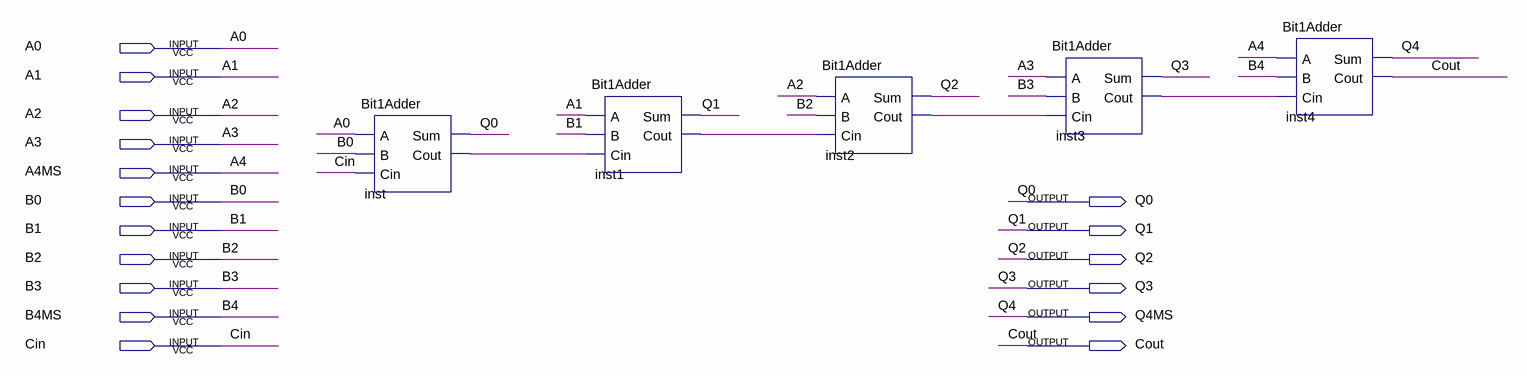
[diagram p0: schematic sheet]
// Quartus schematic AdderV2.bdf as structural Verilog: 5 symbols, 17 pins
module AdderV2 (
  input  A0,
  input  A1,
  input  A2,
  input  A3,
  input  A4MS,
  input  B0,
  input  B1,
  input  B2,
  input  B3,
  input  B4MS,
  input  Cin,
  output Q0,
  output Q1,
  output Q2,
  output Q3,
  output Q4MS,
  output Cout
);

  wire inst1_cout, inst2_cout, inst3_cout, inst_cout;

  Bit1Adder inst (.A(A0), .B(B0), .Cin(Cin), .Sum(Q0), .Cout(inst_cout));
  Bit1Adder inst1 (.A(A1), .B(B1), .Cin(inst_cout), .Sum(Q1), .Cout(inst1_cout));
  Bit1Adder inst2 (.A(A2), .B(B2), .Cin(inst1_cout), .Sum(Q2), .Cout(inst2_cout));
  Bit1Adder inst3 (.A(A3), .B(B3), .Cin(inst2_cout), .Sum(Q3), .Cout(inst3_cout));
  Bit1Adder inst4 (.A(A4MS), .B(B4MS), .Cin(inst3_cout), .Sum(Q4MS), .Cout(Cout));

  // Other names for the same wires on the sheet: A4 = A4MS; B4 = B4MS; Q4 = Q4MS
endmodule
